# Altium schematic sheet MAINCUTTING.SchDoc
size A2
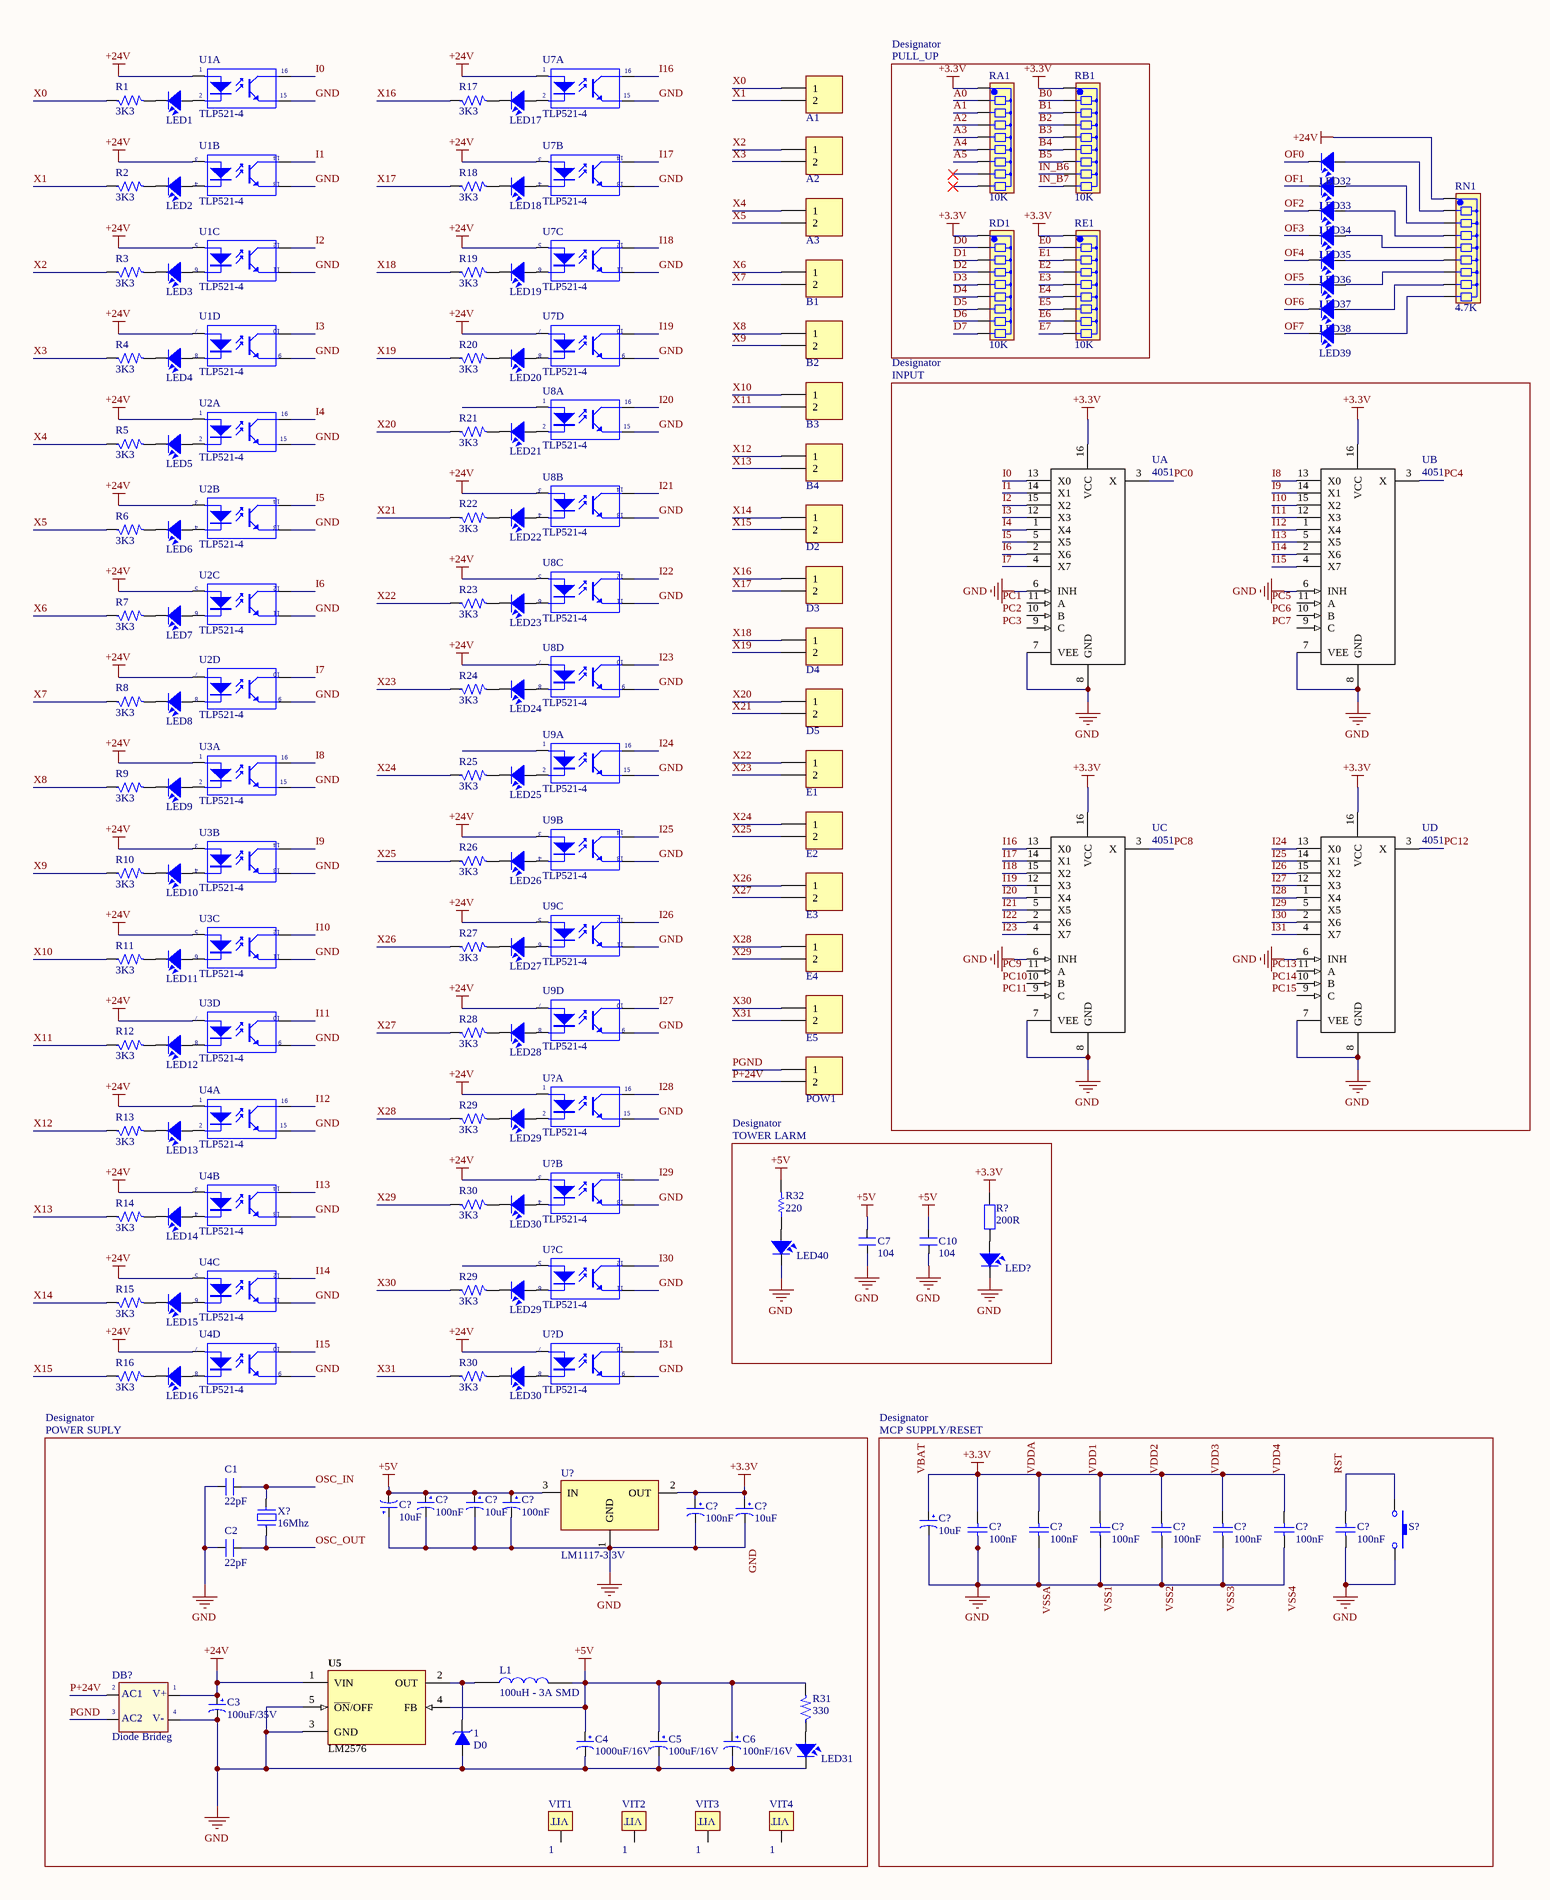
[diagram p0: MAINCUTTING.SchDoc, left]
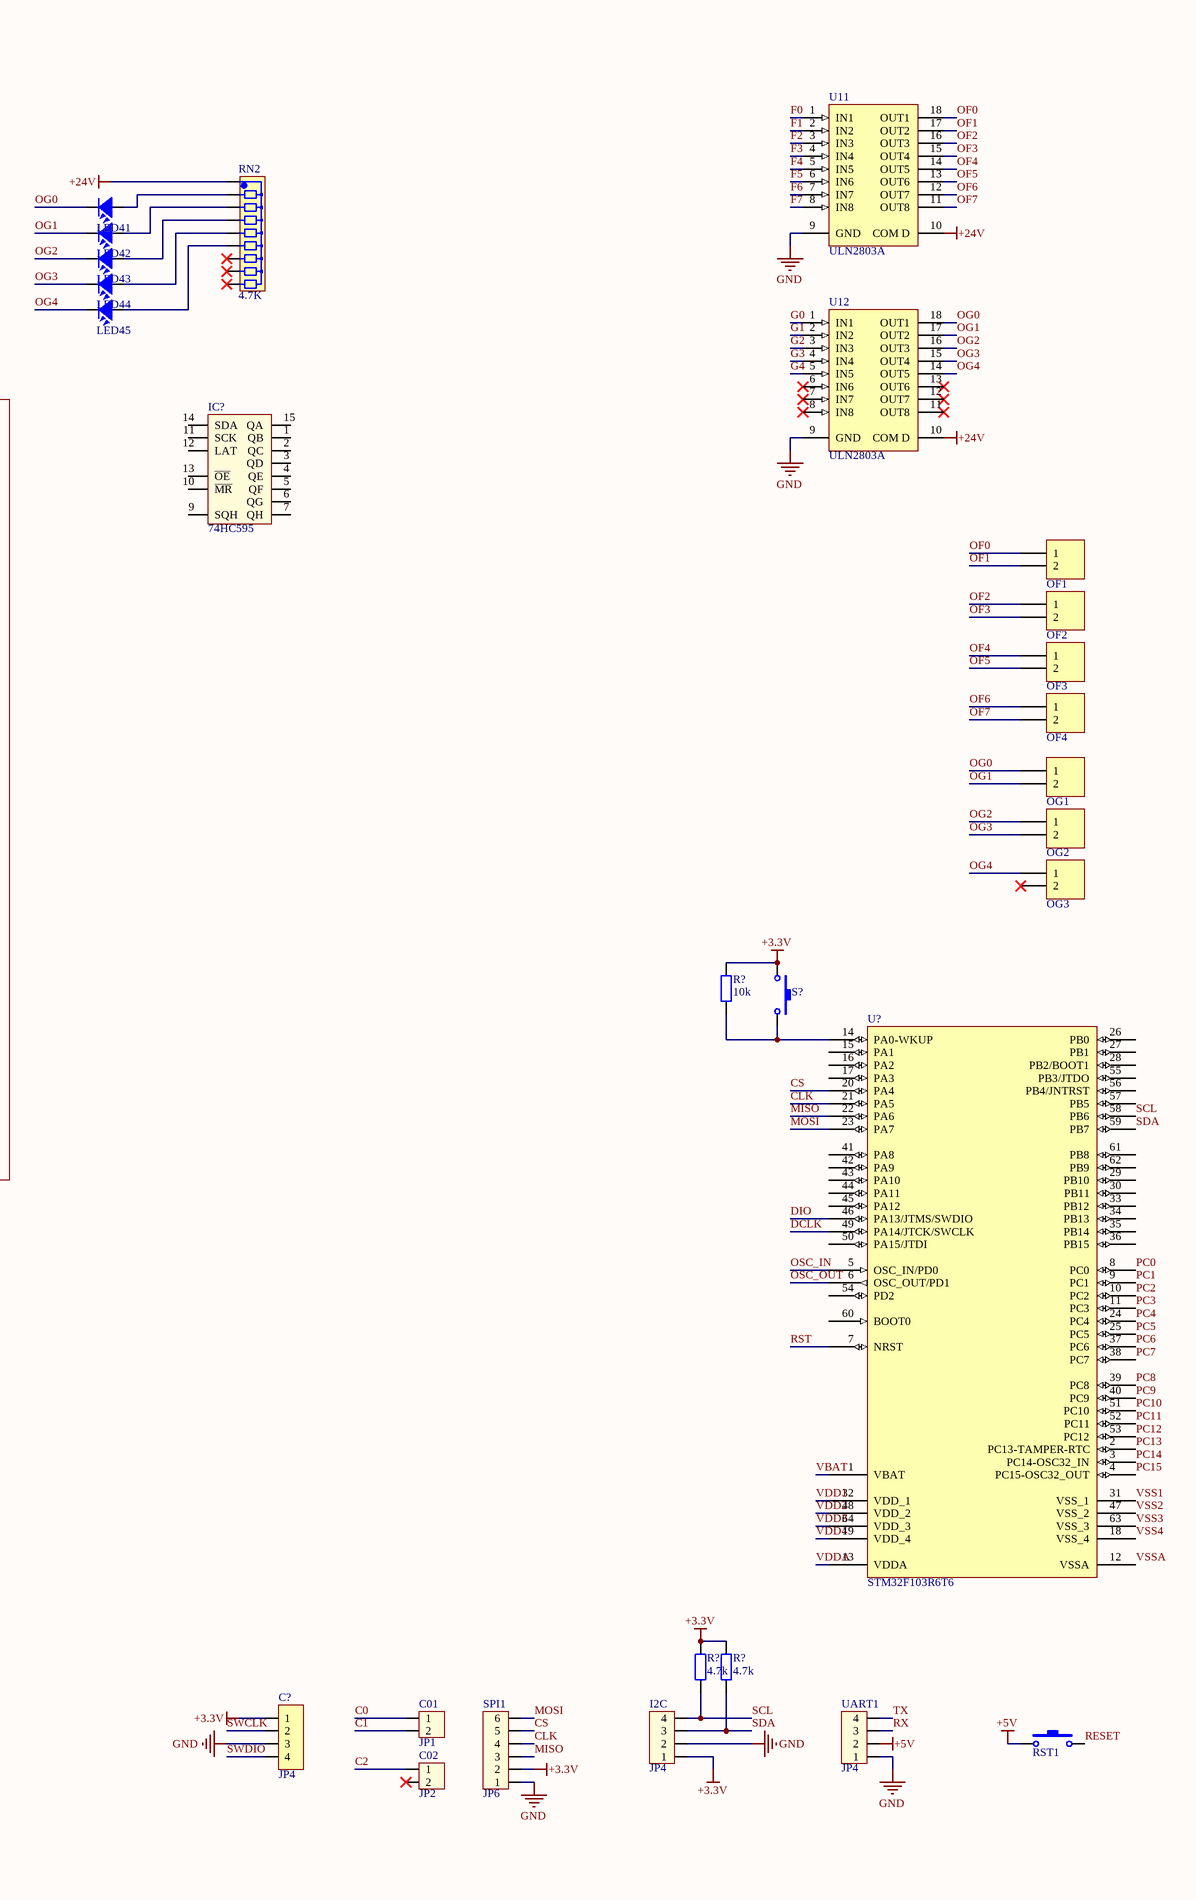
[diagram p1: MAINCUTTING.SchDoc, right]

## Parts
(Parts that share a designator on the sheet are numbered #1, #2 ... from top to bottom, then left to right.)
1  D0  [D1A]
A1  Header 2_1  [HED2]  (value not drawn)
A2  Header 2_1  [HED2]  (value not drawn)
A3  Header 2_1  [HED2]  (value not drawn)
B1  Header 2_1  [HED2]  (value not drawn)
B2  Header 2_1  [HED2]  (value not drawn)
B3  Header 2_1  [HED2]  (value not drawn)
B4  Header 2_1  [HED2]  (value not drawn)
C1  22pF  [CN1]
C01  JP1  [CON2]
C2  22pF  [CN1]
C02  JP2  [CON2]
C3  100uF/35V  [CP1.5/3.4]
C4  1000uF/16V  [CP1.5/3.4]
C5  100uF/16V  [CP1.5/3.4]
C6  100nF/16V  [CP1.5/3.4]
C7  104  [CN2]
C10  104  [CN2]
C?#1  10uF  [CP1/2]
C?#2  100nF  [CP1/2.5]
C?#3  10uF  [CP1/2.5]
C?#4  100nF  [CP1/2.5]
C?#5  100nF  [CP1/2.5]
C?#6  10uF  [CP1/2.5]
C?#7  10uF  [tu tantalum smd3216]
C?#8  100nF  [tu 0402]
C?#9  100nF  [tu 0402]
C?#10  100nF  [tu 0402]
C?#11  100nF  [tu 0402]
C?#12  100nF  [tu 0402]
C?#13  100nF  [tu 0402]
C?#14  100nF  [tu 0402]
C?#15  JP4  [JP4-C1T]
D2  Header 2_1  [HED2]  (value not drawn)
D3  Header 2_1  [HED2]  (value not drawn)
D4  Header 2_1  [HED2]  (value not drawn)
D5  Header 2_1  [HED2]  (value not drawn)
DB?  Diode Brideg  [CAU 5A]
E1  Header 2_1  [HED2]  (value not drawn)
E2  Header 2_1  [HED2]  (value not drawn)
E3  Header 2_1  [HED2]  (value not drawn)
E4  Header 2_1  [HED2]  (value not drawn)
E5  Header 2_1  [HED2]  (value not drawn)
I2C  JP4  [CON4]
IC?  74HC595  [DIP16]
L1  100uH - 3A SMD  [Cuon Cam 7.5x7x5]
LED1  LED SMD  [SM-LED-1206-Blue]  (value not drawn)
LED2  LED SMD  [SM-LED-1206-Blue]  (value not drawn)
LED3  LED SMD  [SM-LED-1206-Blue]  (value not drawn)
LED4  LED SMD  [SM-LED-1206-Blue]  (value not drawn)
LED5  LED SMD  [SM-LED-1206-Blue]  (value not drawn)
LED6  LED SMD  [SM-LED-1206-Blue]  (value not drawn)
LED7  LED SMD  [SM-LED-1206-Blue]  (value not drawn)
LED8  LED SMD  [SM-LED-1206-Blue]  (value not drawn)
LED9  LED SMD  [SM-LED-1206-Blue]  (value not drawn)
LED10  LED SMD  [SM-LED-1206-Blue]  (value not drawn)
LED11  LED SMD  [SM-LED-1206-Blue]  (value not drawn)
LED12  LED SMD  [SM-LED-1206-Blue]  (value not drawn)
LED13  LED SMD  [SM-LED-1206-Blue]  (value not drawn)
LED14  LED SMD  [SM-LED-1206-Blue]  (value not drawn)
LED15  LED SMD  [SM-LED-1206-Blue]  (value not drawn)
LED16  LED SMD  [SM-LED-1206-Blue]  (value not drawn)
LED17  LED SMD  [SM-LED-1206-Blue]  (value not drawn)
LED18  LED SMD  [SM-LED-1206-Blue]  (value not drawn)
LED19  LED SMD  [SM-LED-1206-Blue]  (value not drawn)
LED20  LED SMD  [SM-LED-1206-Blue]  (value not drawn)
LED21  LED SMD  [SM-LED-1206-Blue]  (value not drawn)
LED22  LED SMD  [SM-LED-1206-Blue]  (value not drawn)
LED23  LED SMD  [SM-LED-1206-Blue]  (value not drawn)
LED24  LED SMD  [SM-LED-1206-Blue]  (value not drawn)
LED25  LED SMD  [SM-LED-1206-Blue]  (value not drawn)
LED26  LED SMD  [SM-LED-1206-Blue]  (value not drawn)
LED27  LED SMD  [SM-LED-1206-Blue]  (value not drawn)
LED28  LED SMD  [SM-LED-1206-Blue]  (value not drawn)
LED29#1  LED SMD  [SM-LED-1206-Blue]  (value not drawn)
LED29#2  LED SMD  [SM-LED-1206-Blue]  (value not drawn)
LED30#1  LED SMD  [SM-LED-1206-Blue]  (value not drawn)
LED30#2  LED SMD  [SM-LED-1206-Blue]  (value not drawn)
LED31  LED SMD  [SM-LED-1206-Blue]  (value not drawn)
LED32  LED SMD  [SM-LED-1206-Blue]  (value not drawn)
LED33  LED SMD  [SM-LED-1206-Blue]  (value not drawn)
LED34  LED SMD  [SM-LED-1206-Blue]  (value not drawn)
LED35  LED SMD  [SM-LED-1206-Blue]  (value not drawn)
LED36  LED SMD  [SM-LED-1206-Blue]  (value not drawn)
LED37  LED SMD  [SM-LED-1206-Blue]  (value not drawn)
LED38  LED SMD  [SM-LED-1206-Blue]  (value not drawn)
LED39  LED SMD  [SM-LED-1206-Blue]  (value not drawn)
LED40  LED SMD  [SM-LED-0805-Blue]  (value not drawn)
LED41  LED SMD  [SM-LED-1206-Blue]  (value not drawn)
LED42  LED SMD  [SM-LED-1206-Blue]  (value not drawn)
LED43  LED SMD  [SM-LED-1206-Blue]  (value not drawn)
LED44  LED SMD  [SM-LED-1206-Blue]  (value not drawn)
LED45  LED SMD  [SM-LED-1206-Blue]  (value not drawn)
LED?  LED SMD  [SM-LED-1206-Blue]  (value not drawn)
OF1  Header 2_1  [HED2]  (value not drawn)
OF2  Header 2_1  [HED2]  (value not drawn)
OF3  Header 2_1  [HED2]  (value not drawn)
OF4  Header 2_1  [HED2]  (value not drawn)
OG1  Header 2_1  [HED2]  (value not drawn)
OG2  Header 2_1  [HED2]  (value not drawn)
OG3  Header 2_1  [HED2]  (value not drawn)
POW1  Header 2_1  [HED2]  (value not drawn)
R1  3K3  [SM-RES-1206]
R2  3K3  [SM-RES-1206]
R3  3K3  [SM-RES-1206]
R4  3K3  [SM-RES-1206]
R5  3K3  [SM-RES-1206]
R6  3K3  [SM-RES-1206]
R7  3K3  [SM-RES-1206]
R8  3K3  [SM-RES-1206]
R9  3K3  [SM-RES-1206]
R10  3K3  [SM-RES-1206]
R11  3K3  [SM-RES-1206]
R12  3K3  [SM-RES-1206]
R13  3K3  [SM-RES-1206]
R14  3K3  [SM-RES-1206]
R15  3K3  [SM-RES-1206]
R16  3K3  [SM-RES-1206]
R17  3K3  [SM-RES-1206]
R18  3K3  [SM-RES-1206]
R19  3K3  [SM-RES-1206]
R20  3K3  [SM-RES-1206]
R21  3K3  [SM-RES-1206]
R22  3K3  [SM-RES-1206]
R23  3K3  [SM-RES-1206]
R24  3K3  [SM-RES-1206]
R25  3K3  [SM-RES-1206]
R26  3K3  [SM-RES-1206]
R27  3K3  [SM-RES-1206]
R28  3K3  [SM-RES-1206]
R29#1  3K3  [SM-RES-1206]
R29#2  3K3  [SM-RES-1206]
R30#1  3K3  [SM-RES-1206]
R30#2  3K3  [SM-RES-1206]
R31  330  [SM-RES-1206]
R32  value 220  [R1/4W1]  (hidden comment: Res1)
R?#1  10k  [tro smd 2512]
R?#2  200R  [tro smd 1206]
R?#3  4.7k  [tro smd 0805]
R?#4  4.7k  [tro smd 0805]
RA1  10K  [RN8]
RB1  10K  [RN8]
RD1  10K  [RN8]
RE1  10K  [RN8]
RN1  4.7K  [RN8]
RN2  4.7K  [RN8]
RST1  MH001036  [SW-SMD]  (value not drawn)
S?#1  MH001036  [SW-SMD]  (value not drawn)
S?#2  MH001036  [SW-SMD]  (value not drawn)
SPI1  JP6  [CON6]
U1  TLP521-4  [DIP16]  (parts A,B,C,D of 4)
U2  TLP521-4  [DIP16]  (parts A,B,C,D of 4)
U3  TLP521-4  [DIP16]  (parts A,B,C,D of 4)
U4  TLP521-4  [DIP16]  (parts A,B,C,D of 4)
U5  LM2576  [TO263]
U7  TLP521-4  [DIP16]  (parts A,B,C,D of 4)
U8  TLP521-4  [DIP16]  (parts A,B,C,D of 4)
U9  TLP521-4  [DIP16]  (parts A,B,C,D of 4)
U11  ULN2803A  [DIP18]
U12  ULN2803A  [DIP18]
U?#1  STM32F103R6T6  [LQFP64_N]
U?#2  TLP521-4  [DIP16]  (part A of 4)
U?#3  TLP521-4  [DIP16]  (part B of 4)
U?#4  TLP521-4  [DIP16]  (part C of 4)
U?#5  TLP521-4  [DIP16]  (part D of 4)
U?#6  LM1117-3.3V  [SOT223]
UA  4051  [SO16]
UART1  JP4  [CON4]
UB  4051  [SO16]
UC  4051  [SO16]
UD  4051  [SO16]
VIT1  1  [VIT]
VIT2  1  [VIT]
VIT3  1  [VIT]
VIT4  1  [VIT]
X?  16Mhz  [XT2]

## Sub-sheets
Designator = POWER SUPLY: no entries
Designator = MCP SUPPLY/RESET: no entries
Designator = TOWER LARM: no entries
Designator = INPUT: no entries
Designator = PULL_UP: no entries

## Nets
+5V: C4.1 C5.1 C6.1 C7.2 C10.2 C?#1.2 C?#2.1 C?#3.1 C?#4.1 L1.2 R31.2 R32.2 RST1.1 U5.4(FB) U?#6.3(IN) UART1.2
+24V: C3.1 DB?.1(+V_OUT) RN1.1 RN2.1 U1.1(A) U1.3(A) U1.5(A) U1.7(A) U2.1(A) U2.3(A) U2.5(A) U2.7(A) U3.1(A) U3.3(A) U3.5(A) U3.7(A) U4.1(A) U4.3(A) U4.5(A) U4.7(A) U5.1(VIN) U7.1(A) U7.3(A) U7.5(A) U7.7(A) U8.3(A) U8.5(A) U8.7(A) U9.3(A) U9.5(A) U9.7(A) U11.10(COM_D) U12.10(COM_D) U?#2.1(A) U?#3.3(A) U?#5.7(A)
GND: 1.1(A) C1.1 C2.1 C3.2 C4.2 C5.2 C6.2 C7.1 C10.1 C?#1.1 C?#2.2 C?#3.2 C?#4.2 C?#5.2 C?#6.2 C?#7.2 C?#8.2 C?#9.2 C?#10.2 C?#11.2 C?#12.2 C?#13.2 C?#14.2 C?#15.3 DB?.4(-V_OUT) I2C.2 IC?.8(GND) LED31.2 LED40.2 LED?.2 S?#2.2 SPI1.1 U1.9(E) U1.11(E) U1.13(E) U1.15(E) U2.9(E) U2.11(E) U2.13(E) U2.15(E) U3.9(E) U3.11(E) U3.13(E) U3.15(E) U4.9(E) U4.11(E) U4.13(E) U4.15(E) U5.3(GND) U5.5(~{ON}/OFF) U7.9(E) U7.11(E) U7.13(E) U7.15(E) U8.9(E) U8.11(E) U8.13(E) U8.15(E) U9.9(E) U9.11(E) U9.13(E) U9.15(E) U11.9(GND) U12.9(GND) U?#1.12(VSSA) U?#1.18(VSS_4) U?#1.31(VSS_1) U?#1.47(VSS_2) U?#1.63(VSS_3) U?#2.15(E) U?#3.13(E) U?#4.11(E) U?#5.9(E) U?#6.1(GND) UA.6(INH) UA.7(VEE) UA.8(GND) UART1.1 UB.6(INH) UB.7(VEE) UB.8(GND) UC.6(INH) UC.7(VEE) UC.8(GND) UD.6(INH) UD.7(VEE) UD.8(GND)  [also labelled VSS1, VSS2, VSS3, VSS4, VSSA]
VBAT: C?#5.1 C?#6.1 C?#7.1 C?#8.1 C?#9.1 C?#10.1 C?#11.1 C?#12.1 C?#13.1 C?#15.1 I2C.1 R?#1.2 R?#2.2 R?#3.2 R?#4.2 RA1.1 RB1.1 RD1.1 RE1.1 S?#1.1 SPI1.2 U?#1.1(VBAT) U?#1.13(VDDA) U?#1.19(VDD_4) U?#1.32(VDD_1) U?#1.48(VDD_2) U?#1.64(VDD_3) U?#6.2(OUT) UA.16(VCC) UB.16(VCC) UC.16(VCC) UD.16(VCC)  [also labelled +3.3V, VDD1, VDD2, VDD3, VDD4, VDDA]
VCC: IC?.16(VCC)
A0: RA1.2
A1: RA1.3
A2: RA1.4
A3: RA1.5
A4: RA1.6
A5: RA1.7
B0: RB1.2
B1: RB1.3
B2: RB1.4
B3: RB1.5
B4: RB1.6
B5: RB1.7
C0: C01.1
C1: C01.2
C2: C02.1
CLK: SPI1.4 U?#1.21(PA5)
CS: SPI1.5 U?#1.20(PA4)
D0: RD1.2
D1: RD1.3
D2: RD1.4
D3: RD1.5
D4: RD1.6
D5: RD1.7
D6: RD1.8
D7: RD1.9
DCLK: U?#1.49(PA14/JTCK/SWCLK)
DIO: U?#1.46(PA13/JTMS/SWDIO)
E0: RE1.2
E1: RE1.3
E2: RE1.4
E3: RE1.5
E4: RE1.6
E5: RE1.7
E6: RE1.8
E7: RE1.9
F0: U11.1(IN1)
F1: U11.2(IN2)
F2: U11.3(IN3)
F3: U11.4(IN4)
F4: U11.5(IN5)
F5: U11.6(IN6)
F6: U11.7(IN7)
F7: U11.8(IN8)
G0: U12.1(IN1)
G1: U12.2(IN2)
G2: U12.3(IN3)
G3: U12.4(IN4)
G4: U12.5(IN5)
I0: U1.16(C) UA.13(X0)
I1: U1.14(C) UA.14(X1)
I2: U1.12(C) UA.15(X2)
I3: U1.10(C) UA.12(X3)
I4: U2.16(C) UA.1(X4)
I5: U2.14(C) UA.5(X5)
I6: U2.12(C) UA.2(X6)
I7: U2.10(C) UA.4(X7)
I8: U3.16(C) UB.13(X0)
I9: U3.14(C) UB.14(X1)
I10: U3.12(C) UB.15(X2)
I11: U3.10(C) UB.12(X3)
I12: U4.16(C) UB.1(X4)
I13: U4.14(C) UB.5(X5)
I14: U4.12(C) UB.2(X6)
I15: U4.10(C) UB.4(X7)
I16: U7.16(C) UC.13(X0)
I17: U7.14(C) UC.14(X1)
I18: U7.12(C) UC.15(X2)
I19: U7.10(C) UC.12(X3)
I20: U8.16(C) UC.1(X4)
I21: U8.14(C) UC.5(X5)
I22: U8.12(C) UC.2(X6)
I23: U8.10(C) UC.4(X7)
I24: U9.16(C) UD.13(X0)
I25: U9.14(C) UD.14(X1)
I26: U9.12(C) UD.15(X2)
I27: U9.10(C) UD.12(X3)
I28: U?#2.16(C) UD.1(X4)
I29: U?#3.14(C) UD.5(X5)
I30: U?#4.12(C) UD.2(X6)
I31: U?#5.10(C) UD.4(X7)
IN_B6: RB1.8
IN_B7: RB1.9
MISO: SPI1.3 U?#1.22(PA6)
MOSI: SPI1.6 U?#1.23(PA7)
OF0: LED32.2 OF1.1 U11.18(OUT1)
OF1: LED33.2 OF1.2 U11.17(OUT2)
OF2: LED34.2 OF2.1 U11.16(OUT3)
OF3: LED35.2 OF2.2 U11.15(OUT4)
OF4: LED36.2 OF3.1 U11.14(OUT5)
OF5: LED37.2 OF3.2 U11.13(OUT6)
OF6: LED38.2 OF4.1 U11.12(OUT7)
OF7: LED39.2 OF4.2 U11.11(OUT8)
OG0: LED41.2 OG1.1 U12.18(OUT1)
OG1: LED42.2 OG1.2 U12.17(OUT2)
OG2: LED43.2 OG2.1 U12.16(OUT3)
OG3: LED44.2 OG2.2 U12.15(OUT4)
OG4: LED45.2 OG3.1 U12.14(OUT5)
OSC_IN: C1.2 U?#1.5(OSC_IN/PD0) X?.2
OSC_OUT: C2.2 U?#1.6(OSC_OUT/PD1) X?.1
P+24V: DB?.2(AC1) POW1.2
PC0: U?#1.8(PC0) UA.3(X)
PC1: U?#1.9(PC1)
PC2: U?#1.10(PC2)
PC3: U?#1.11(PC3)
PC4: U?#1.24(PC4) UB.3(X)
PC5: U?#1.25(PC5)
PC6: U?#1.37(PC6)
PC7: U?#1.38(PC7)
PC8: U?#1.39(PC8) UC.3(X)
PC9: U?#1.40(PC9)
PC10: U?#1.51(PC10)
PC11: U?#1.52(PC11)
PC12: U?#1.53(PC12) UD.3(X)
PC13: U?#1.2(PC13-TAMPER-RTC)
PC14: U?#1.3(PC14-OSC32_IN)
PC15: U?#1.4(PC15-OSC32_OUT)
PGND: DB?.3(AC2) POW1.1
RESET: RST1.2
RST: C?#14.1 S?#2.1 U?#1.7(NRST)
RX: UART1.3
SCL: I2C.4 R?#3.1 U?#1.58(PB6)
SDA: I2C.3 R?#4.1 U?#1.59(PB7)
SWCLK: C?#15.2
SWDIO: C?#15.4
TX: UART1.4
X0: A1.1 R1.1
X1: A1.2 R2.1
X2: A2.1 R3.1
X3: A2.2 R4.1
X4: A3.1 R5.1
X5: A3.2 R6.1
X6: B1.1 R7.1
X7: B1.2 R8.1
X8: B2.1 R9.1
X9: B2.2 R10.1
X10: B3.1 R11.1
X11: B3.2 R12.1
X12: B4.1 R13.1
X13: B4.2 R14.1
X14: D2.1 R15.1
X15: D2.2 R16.1
X16: D3.1 R17.1
X17: D3.2 R18.1
X18: D4.1 R19.1
X19: D4.2 R20.1
X20: D5.1 R21.1
X21: D5.2 R22.1
X22: E1.1 R23.1
X23: E1.2 R24.1
X24: E2.1 R25.1
X25: E2.2 R26.1
X26: E3.1 R27.1
X27: E3.2 R28.1
X28: E4.1 R29#1.1
X29: E4.2 R30#1.1
X30: E5.1 R29#2.1
X31: E5.2 R30#2.1
Net1_2: 1.2(K) L1.1 U5.2(OUT)
NetLED1_1: LED1.1 U1.2(K)
NetLED1_2: LED1.2 R1.2
NetLED2_1: LED2.1 U1.4(K)
NetLED2_2: LED2.2 R2.2
NetLED3_1: LED3.1 U1.6(K)
NetLED3_2: LED3.2 R3.2
NetLED4_1: LED4.1 U1.8(K)
NetLED4_2: LED4.2 R4.2
NetLED5_1: LED5.1 U2.2(K)
NetLED5_2: LED5.2 R5.2
NetLED6_1: LED6.1 U2.4(K)
NetLED6_2: LED6.2 R6.2
NetLED7_1: LED7.1 U2.6(K)
NetLED7_2: LED7.2 R7.2
NetLED8_1: LED8.1 U2.8(K)
NetLED8_2: LED8.2 R8.2
NetLED9_1: LED9.1 U3.2(K)
NetLED9_2: LED9.2 R9.2
NetLED10_1: LED10.1 U3.4(K)
NetLED10_2: LED10.2 R10.2
NetLED11_1: LED11.1 U3.6(K)
NetLED11_2: LED11.2 R11.2
NetLED12_1: LED12.1 U3.8(K)
NetLED12_2: LED12.2 R12.2
NetLED13_1: LED13.1 U4.2(K)
NetLED13_2: LED13.2 R13.2
NetLED14_1: LED14.1 U4.4(K)
NetLED14_2: LED14.2 R14.2
NetLED15_1: LED15.1 U4.6(K)
NetLED15_2: LED15.2 R15.2
NetLED16_1: LED16.1 U4.8(K)
NetLED16_2: LED16.2 R16.2
NetLED17_1: LED17.1 U7.2(K)
NetLED17_2: LED17.2 R17.2
NetLED18_1: LED18.1 U7.4(K)
NetLED18_2: LED18.2 R18.2
NetLED19_1: LED19.1 U7.6(K)
NetLED19_2: LED19.2 R19.2
NetLED20_1: LED20.1 U7.8(K)
NetLED20_2: LED20.2 R20.2
NetLED21_1: LED21.1 U8.2(K)
NetLED21_2: LED21.2 R21.2
NetLED22_1: LED22.1 U8.4(K)
NetLED22_2: LED22.2 R22.2
NetLED23_1: LED23.1 U8.6(K)
NetLED23_2: LED23.2 R23.2
NetLED24_1: LED24.1 U8.8(K)
NetLED24_2: LED24.2 R24.2
NetLED25_1: LED25.1 U9.2(K)
NetLED25_2: LED25.2 R25.2
NetLED26_1: LED26.1 U9.4(K)
NetLED26_2: LED26.2 R26.2
NetLED27_1: LED27.1 U9.6(K)
NetLED27_2: LED27.2 R27.2
NetLED28_1: LED28.1 U9.8(K)
NetLED28_2: LED28.2 R28.2
NetLED29#1_1: LED29#1.1 U?#2.2(K)
NetLED29#1_2: LED29#1.2 R29#1.2
NetLED29#2_1: LED29#2.1 U?#4.6(K)
NetLED29#2_2: LED29#2.2 R29#2.2
NetLED30#1_1: LED30#1.1 U?#3.4(K)
NetLED30#1_2: LED30#1.2 R30#1.2
NetLED30#2_1: LED30#2.1 U?#5.8(K)
NetLED30#2_2: LED30#2.2 R30#2.2
NetLED31_1: LED31.1 R31.1
NetLED32_1: LED32.1 RN1.2
NetLED33_1: LED33.1 RN1.3
NetLED34_1: LED34.1 RN1.4
NetLED35_1: LED35.1 RN1.5
NetLED36_1: LED36.1 RN1.6
NetLED37_1: LED37.1 RN1.7
NetLED38_1: LED38.1 RN1.8
NetLED39_1: LED39.1 RN1.9
NetLED40_1: LED40.1 R32.1
NetLED41_1: LED41.1 RN2.2
NetLED42_1: LED42.1 RN2.3
NetLED43_1: LED43.1 RN2.4
NetLED44_1: LED44.1 RN2.5
NetLED45_1: LED45.1 RN2.6
NetLED?_1: LED?.1 R?#2.1
NetR?#1_1: R?#1.1 S?#1.2 U?#1.14(PA0-WKUP)

Not connected (* = marked no-connect by the designer): C02 2*; IC? 1(QB) 2(QC) 3(QD) 4(QE) 5(QF) 6(QG) 7(QH) 9(SQH) 10(~{MR}) 11(SCK) 12(LAT) 13(~{OE}) 14(SDA) 15(QA); OG3 2*; RA1 8* 9*; RN2 7* 8* 9*; U8 1(A); U9 1(A); U12 6(IN6)* 7(IN7)* 8(IN8)* 11(OUT8)* 12(OUT7)* 13(OUT6)*; U?#1 15(PA1) 16(PA2) 17(PA3) 26(PB0) 27(PB1) 28(PB2/BOOT1) 29(PB10) 30(PB11) 33(PB12) 34(PB13) 35(PB14) 36(PB15) 41(PA8) 42(PA9) 43(PA10) 44(PA11) 45(PA12) 50(PA15/JTDI) 54(PD2) 55(PB3/JTDO) 56(PB4/JNTRST) 57(PB5) 60(BOOT0) 61(PB8) 62(PB9); U?#4 5(A); UA 9(C) 10(B) 11(A); UB 9(C) 10(B) 11(A); UC 9(C) 10(B) 11(A); UD 9(C) 10(B) 11(A); VIT1 VIT1(1); VIT2 VIT1(1); VIT3 VIT1(1); VIT4 VIT1(1)

## Notes on the sheet
- Labels drawn without touching a wire or pin: PC1, PC2, PC3, PC5, PC6, PC7, PC9, PC10, PC11, PC13, PC14, PC15
- (in symbol DB) V+; V-

## Library data of the parts
1 = Zener
A1-A3 B1-B4 D2-D5 E1-E5 OF1-OF4 OG1-OG3 POW1 = Header 2_1: Header, 2-Pin; Manufacturer: Generic Components; Class: Connector; Value: Header 2
C1 C2 = CN1: Cap np  1pF - 472pF; Value: 100pF
C01 C02 = Con2: Connector 2; Value: Connector 2
C3 = CP3: Cap 100uF/35V - 470uF/16V; Value: 100uF/35V/50V; Description 1: 1000uF/6,3V - 470uF/16V - 330uF - 25V; Description 2: 220uF/35V - 100uF/50V - 63V - 4,7uF/200V; Description 3: 22uF => 33uF100V - 3,3uF => 4,7uF/250V; Description 4: 2,2uF =>3,3uF/350 - 2,2uF/400V - 1uF/450V
C4-C6 = CP4: Cap 1000uF/16V - 220uF/50V; Description 5: 4,7uF>10uF/250V_3,3uF>10uF/400V - 2,2uF>4,7uF/450V; Description 1: 2200uF-3300uF/6,3V - 1000uF-2200uF/10V; Description 2: 1000uF/16V - 470uF => 1000uF/25V - 100uF/100V; Description 3: 330uF>470uF/35V_220uF>470uF/50V_10uF>22uF/250V; Description 4: 220uF => 330uF/63V - 10uF =>33uF/160 - 200V; Value: 1000uF/16V
C7 C10 = CN2: Cap np 104 => 105pF; Value: 0.1uF
C?#1 = CP1: Cap P  0,1uF < 22uF , 16 - 50V; Value: 10uF/50V; Description 1: 10 => 220uF/6,3V/10V - 10uF => 100uF/16V; Description 2: 0,1uF => 33uF/50V - 10uF => 22uF/63V; Description 3: 0,47uF => 10uF/100V
C?#2-C?#6 = CP2: C 47uF/50V , 220uF/16V; Value: 47uF/16 - 50V; Description 1: 470uF/6,3V - 330uF/10V - 220uF/16V; Description 2: 100uF/25V - 35V - 47uF/50V - 22uF/100V; Description 3: 33uF => 47uF/63V - 1uF => 4,7uF/160V; Description 4: 1uF => 2,2uF/250V - 1uF/350V
C?#7 = Tu tantalum 10uF 16V SMD3216: Dán; Don_Vi: Con; So_Chan: 2; Ten_Linh_Kien: Tụ tantalum 106C-10uF 16V SMD3216; Ma_Hang: MH001954; Chung_Loai: Dán; Kieu_Chan: *
C?#8-C?#14 = Tu 0402 220nF 6.3V 20%: Dán; Don_Vi: Con; So_Chan: 2; Ten_Linh_Kien: Tụ 0402 220nF 6.3V 20%; Ma_Hang: MH008102; Chung_Loai: Dán; Kieu_Chan: *
C?#15 = JP4: WR-PHD 2.54 mm Angled Socket Header; Manufacturer: W¨¹rth Elektronik eiSos GmbH; partNo: 613004143121; ComponentLink1 Description: Manufacturer; ComponentLink2 Description: Datasheet; NoPins: 04; Created Date: 29 March 2013; ComponentLink1URL: http://www.we-online.com; ComponentLink2URL: http://katalog.we-online.de/em/datasheet/6130xx143121.pdf; Created by: Karrer Zheng
DB? = DB: Convert AC to DC voltage, 4 pin; Value: Cau 1A
I2C UART1 = Con4: Connector 4; Value: Connector 4
IC? = 74595: 8 Bit Serial input - Parallel Output; Value: 74HC595
L1 = CUON CAM 100uH_SMD: Dán; Ma_Hang: MH003999; Don_Vi: Con; Ten_Linh_Kien: Cuộn Cảm 100uH 7x7x4MM CD74; Kieu_Chan: *; Chung_Loai: Dán
LED1-LED28 LED29#1 LED29#2 LED30#1 LED30#2 LED31-LED39 LED41-LED45 LED? = LED-SMD-1206
LED40 = LED-SMD-0805
R1-R28 R29#1 R29#2 R30#1 R30#2 R31 = R: Resistor 1/4W; Value: R1/4W - 1K
R32 = Res1_5: Resistor; Manufacturer: Generic Components; Class: Passive; Published: 08/06/2000; Publisher: Altium Hobart Technology Centre; SubClass: Resistor
R?#1 = Tro 2512 5% 10k: Dán; Don_Vi: Con; Ten_Linh_Kien: Trở 2512 5% 103-10k 1W; So_Chan: 2; Ma_Hang: MH003439; Chung_Loai: Dán; Kieu_Chan: *
R?#2 = Tro 1206 5% 200R: Dán; Don_Vi: Con; So_Chan: 2; Ten_Linh_Kien: Trở 1206 5% 200R; Ma_Hang: MH005924; Chung_Loai: Dán; Kieu_Chan: *
R?#3 R?#4 = Tro 0805 5% 4.7k: Dán; Don_Vi: Con; So_Chan: 2; Ten_Linh_Kien: Trở 0805 5% 4.7k; Ma_Hang: MH005307; Chung_Loai: Dán; Kieu_Chan: *
RA1 RB1 RD1 RE1 RN1 RN2 = RN8: Resistor 8 (Thanh); Value: Tro thanh 10K
RST1 S?#1 S?#2 = SW-SMD: Dán; Value: Nút Nhấn 2 Chân 3x6x2.5MM SMD
SPI1 = Con6: Connector 6; Value: Connector 6
U1-U4 U7-U9 U?#2-U?#5 = TLP521-4: Four Opto; Value: TLP521-4
U5 = LM2576: Max Input Voltage: 12 V; Max Output Current: 3 (6.0 peak) A; Max Output Voltage: mV; Category: IC-Power; Min Input Voltage: mV; Min Output Voltage: mV; Mounting Technology: Surface Mount; Status: Unreleased; Supply Voltage: mV; Temperature Range: -40 to +125 degC
U11 U12 = ULN2803A: High-Voltage, High-Current Darlington Array; Published: 13-Oct-2000; LatestRevisionDate: 06-Jun-2005; LatestRevisionNote: Stylized 3D Model Added.; DatasheetVersion: 1999; PackageVersion: 1999; PackageReference: A18; Publisher: Altium Limited; PackageDescription: DIP; 18 Leads; Row Spacing 7.62 mm; Pitch 2.54 mm; ComponentLink1Description: Manufacturer Link; ComponentLink1URL: http://www.allegromicro.com/
U?#1 = STM32F103R6T6: STM32 ARM-based 32-bit MCU with 32 Kbytes Flash, 64-pin LQFP, Industrial Temperature; Published: 30-May-2008; DatasheetVersion: rev6, Mar-2008; PackageVersion: Mar-2008; PackageReference: LQFP64; Publisher: Altium Limited; PackageDescription: 64-Pin Low-Profile Quad Flat Pack, 10 x 10 mm Body, 0.5 mm Pitch (LQFP64); ComponentLink1Description: Manufacturer Link; ComponentLink1URL: www.st.com/stm32; ComponentLink2Description: Datasheet; ComponentLink2URL: http://www.st.com/stonline/products/literature/ds/13587.pdf
U?#6 = LM1117: 800mA Low-Dropout Linear Regulator; Creator: Nguyen Ba Bien; Website: http://group3i.net
VIT1-VIT4 = VIT: Oc Vit
X? = XT2: Crystal, 32.768 KHz, -40 to 85 degC, 3.2 x 1.5 x 0.9 mm SMD; Value: 4Mhz